# EAGLE design control_panel (EAGLE 5.09)
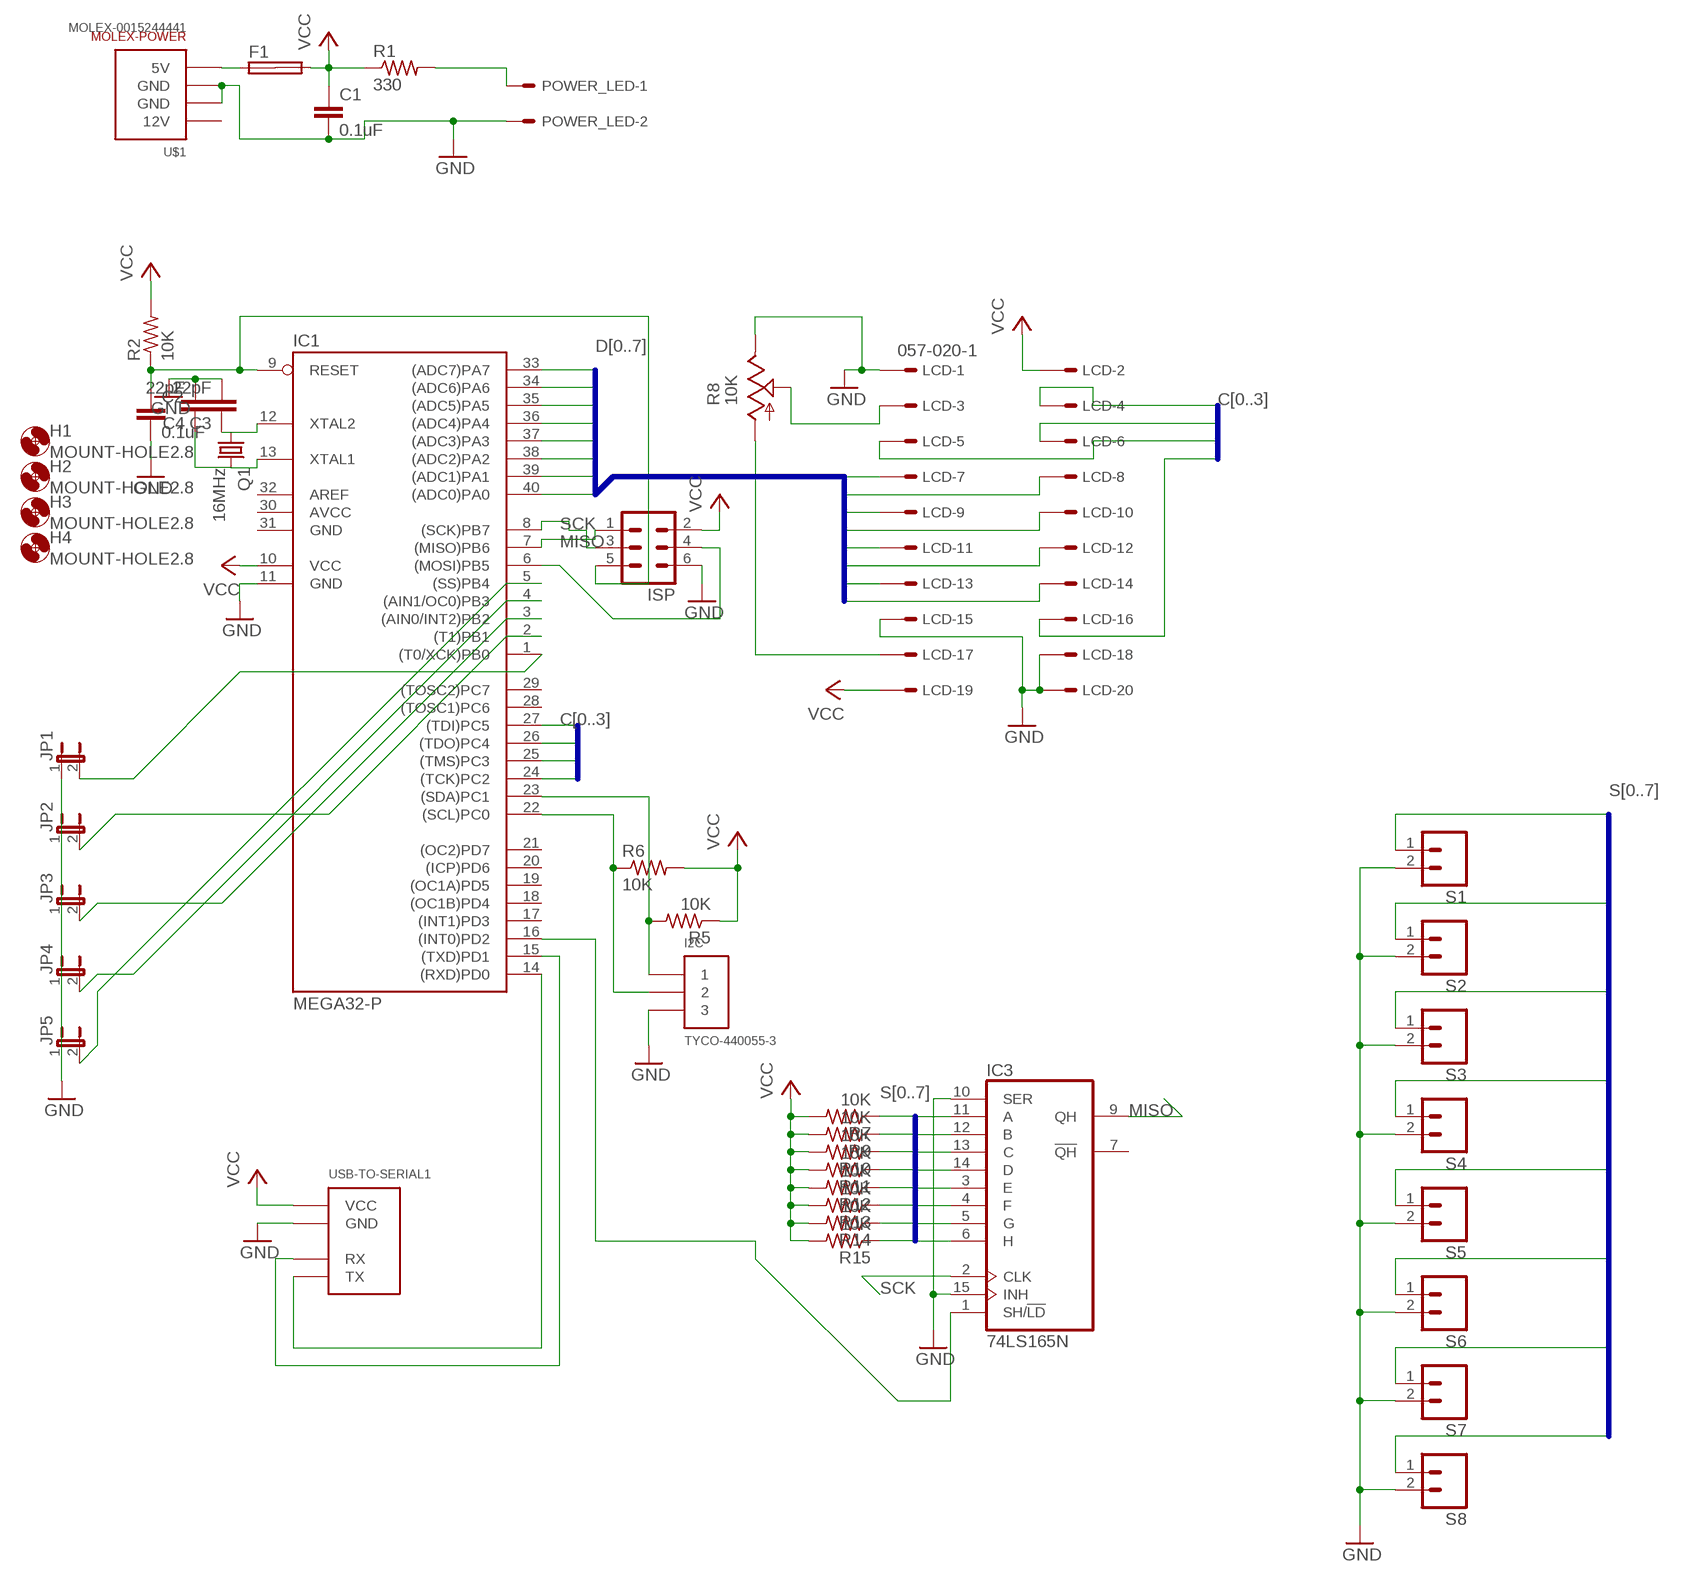
[diagram p0: schematic, sheet 1]

## Parts
C1  0.1uF  C2.5/4  [C2.5-4]
C2  0.1uF  C5/3  [C5B3]
C3  22pF  C2.5/4  [C2.5-4]
C4  22pF  C2.5/4  [C2.5-4]
F1  SHK20Q  [SHK20Q]
H1  MOUNT-HOLE2.8  [2,8]
H2  MOUNT-HOLE2.8  [2,8]
H3  MOUNT-HOLE2.8  [2,8]
H4  MOUNT-HOLE2.8  [2,8]
I2C  TYCO-440055-3  [HEADER-RA-2.00MM-3]
IC1  MEGA32-P  [DIL40]
IC3  74LS165N  [DIL16]
ISP  MA03-2  [MA03-2]
JP1  JUMPER-2PTH  [1X02]
JP2  JUMPER-2PTH  [1X02]
JP3  JUMPER-2PTH  [1X02]
JP4  JUMPER-2PTH  [1X02]
JP5  JUMPER-2PTH  [1X02]
LCD  057-020-1  [057-020-1]
POWER_LED  KK-156-2  [KK-156-2]
Q1  16MHz  CRYSTALHC49S  [HC49/S]
R1  330  R-US_0204/7  [0204/7]
R2  10K  R-US_0204/7  [0204/7]
R5  10K  R-US_0204/7  [0204/7]
R6  10K  R-US_0204/7  [0204/7]
R7  10K  R-US_0204/7  [0204/7]
R8  10K  TRIM_US-B25U  [B25U]
R9  10K  R-US_0204/7  [0204/7]
R10  10K  R-US_0204/7  [0204/7]
R11  10K  R-US_0204/7  [0204/7]
R12  10K  R-US_0204/7  [0204/7]
R13  10K  R-US_0204/7  [0204/7]
R14  10K  R-US_0204/7  [0204/7]
R15  10K  R-US_0204/7  [0204/7]
S1  M02PTH  [1X02]
S2  M02PTH  [1X02]
S3  M02PTH  [1X02]
S4  M02PTH  [1X02]
S5  M02PTH  [1X02]
S6  M02PTH  [1X02]
S7  M02PTH  [1X02]
S8  M02PTH  [1X02]
U$1  MOLEX-0015244441  [MOLEX-0015244441B]
USB-TO-SERIAL1  USB-TO-SERIAL-SQUARE  [USB-TO-SERIAL.SQUARE]

## Nets
C0: IC1.24((TCK)PC2) LCD.4
C1: IC1.25((TMS)PC3) LCD.6
C2: IC1.26((TDO)PC4) LCD.5
C3: IC1.27((TDI)PC5) LCD.16
D0: IC1.40((ADC0)PA0) LCD.7
D1: IC1.39((ADC1)PA1) LCD.8
D2: IC1.38((ADC2)PA2) LCD.9
D3: IC1.37((ADC3)PA3) LCD.10
D4: IC1.36((ADC4)PA4) LCD.11
D5: IC1.35((ADC5)PA5) LCD.12
D6: IC1.34((ADC6)PA6) LCD.13
D7: IC1.33((ADC7)PA7) LCD.14
GND: C1.2 C2.2 C3.2 C4.2 I2C.3 IC1.11(GND) IC3.10(SER) IC3.15(INH) ISP.6 JP1.1 JP2.1 JP3.1 JP4.1 JP5.1 LCD.1 LCD.15 LCD.18 LCD.20 POWER_LED.2 R8.E S1.2 S2.2 S3.2 S4.2 S5.2 S6.2 S7.2 S8.2 U$1.2(GND) U$1.3(GND) USB-TO-SERIAL1.GND
MISO: IC1.7((MISO)PB6) IC3.9(QH) ISP.1
N$1: F1.1A U$1.4(5V)
N$2: POWER_LED.1 R1.2
N$3: C2.1 IC1.9(RESET) ISP.5 R2.1
N$4: IC1.16((INT0)PD2) IC3.1(SH/!LD)
N$5: C4.1 IC1.13(XTAL1) Q1.2
N$7: IC1.14((RXD)PD0) USB-TO-SERIAL1.TX
N$8: IC1.15((TXD)PD1) USB-TO-SERIAL1.RX
N$9: IC1.1((T0/XCK)PB0) JP1.2
N$10: IC1.2((T1)PB1) JP2.2
N$11: IC1.3((AIN0/INT2)PB2) JP3.2
N$12: IC1.4((AIN1/OC0)PB3) JP4.2
N$13: IC1.5((SS)PB4) JP5.2
N$14: I2C.1 IC1.23((SDA)PC1) R5.2
N$15: I2C.2 IC1.22((SCL)PC0) R6.1
N$16: C3.1 IC1.12(XTAL2) Q1.1
N$19: IC1.6((MOSI)PB5) ISP.4
N$20: LCD.3 R8.S
N$21: LCD.17 R8.A
S0: IC3.11(A) R7.1 S1.1
S1: IC3.12(B) R9.1 S2.1
S2: IC3.13(C) R10.1 S3.1
S3: IC3.14(D) R11.1 S4.1
S4: IC3.3(E) R12.1 S5.1
S5: IC3.4(F) R13.1 S6.1
S6: IC3.5(G) R14.1 S7.1
S7: IC3.6(H) R15.1 S8.1
SCK: IC1.8((SCK)PB7) IC3.2(CLK) ISP.3
VCC: C1.1 F1.2A IC1.10(VCC) ISP.2 LCD.2 LCD.19 R1.1 R2.2 R5.1 R6.2 R7.2 R9.2 R10.2 R11.2 R12.2 R13.2 R14.2 R15.2 USB-TO-SERIAL1.VCC
Unconnected: F1.1B F1.2B IC1.17((INT1)PD3) IC1.18((OC1B)PD4) IC1.19((OC1A)PD5) IC1.20((ICP)PD6) IC1.21((OC2)PD7) IC1.28((TOSC1)PC6) IC1.29((TOSC2)PC7) IC1.32(AREF) IC3.7(!QH)

## Buses
D[0..7]
S[0..7]
C[0..3]

## Power pins joined to a net without a drawn wire
12V: U$1.1(12V)
AVCC: IC1.30(AVCC)
GND: IC1.31(GND) IC3.8(GND)
VCC: IC3.16(VCC)

## Library data of the parts
C1-C4 = capacitor-wima:C: CAPACITOR naming: grid - package width
F1 = fuse:SHK20Q: FUSE HOLDER 5 x 20 mm, SH contact, E1207 Buerklin 64G6061
H1-H4 = holes:MOUNT-HOLE: MOUNTING HOLE with drill center marker
I2C = chicagoedt:TYCO-440055-3: 3 pin right angle header with shroud and 2.00 mm pitch.
IC1 = atmel:MEGA32-P: MICROCONTROLLER 32 Kbytes FLASH 2 Kbytes SRAM 1 Kbytes EEPROM USART 8-channel 10 bit ADC Source: www.atmel.com .. doc2503.pdf
IC3 = 74xx-us:74*165: 8-bit parallel load SHIFT REGISTER
ISP = con-lstb:MA03-2: PIN HEADER
JP1-JP5 = SparkFun:JUMPER-2: Jumper Basic 0.1" spaced jumper. Use with breakaway headers.
LCD = con-panduit:057-020-: CONNECTOR 20-pin series 057 contact pc board low profile headers
POWER_LED = con-molex:KK-156-2: KK 156 HEADER Source: http://www.molex.com/pdm_docs/sd/026604100_sd.pdf
Q1 = crystal:CRYSTAL: CRYSTAL
R1 R2 R5-R7 R9-R15 = rcl:R-US_: RESISTOR, American symbol
R8 = pot:TRIM_US-: POTENTIOMETER
S1-S8 = SparkFun:M02: Header 2 Standard 2-pin 0.1" header. Use with straight break away headers (SKU : PRT-00116), right angle break away headers (PRT-00553), swiss pins (PRT-00743), machine pins (PRT-00117), and female headers (PRT-00115). Molex polarized connector foot print use with SKU : PRT-08233 with associated crimp pins and housings.
U$1 = chicagoedt:MOLEX-0015244441: 5.08mm (.200") Pitch Disk Drive Power Connection System Header, Right Angle, Through Hole, 4 Circuits, Lead-free, 3.56mm (.140") PC Tail Length, with PCB Locator Peg
USB-TO-SERIAL1 = chicagoedt:USB-TO-SERIAL-SQUARE

## Board
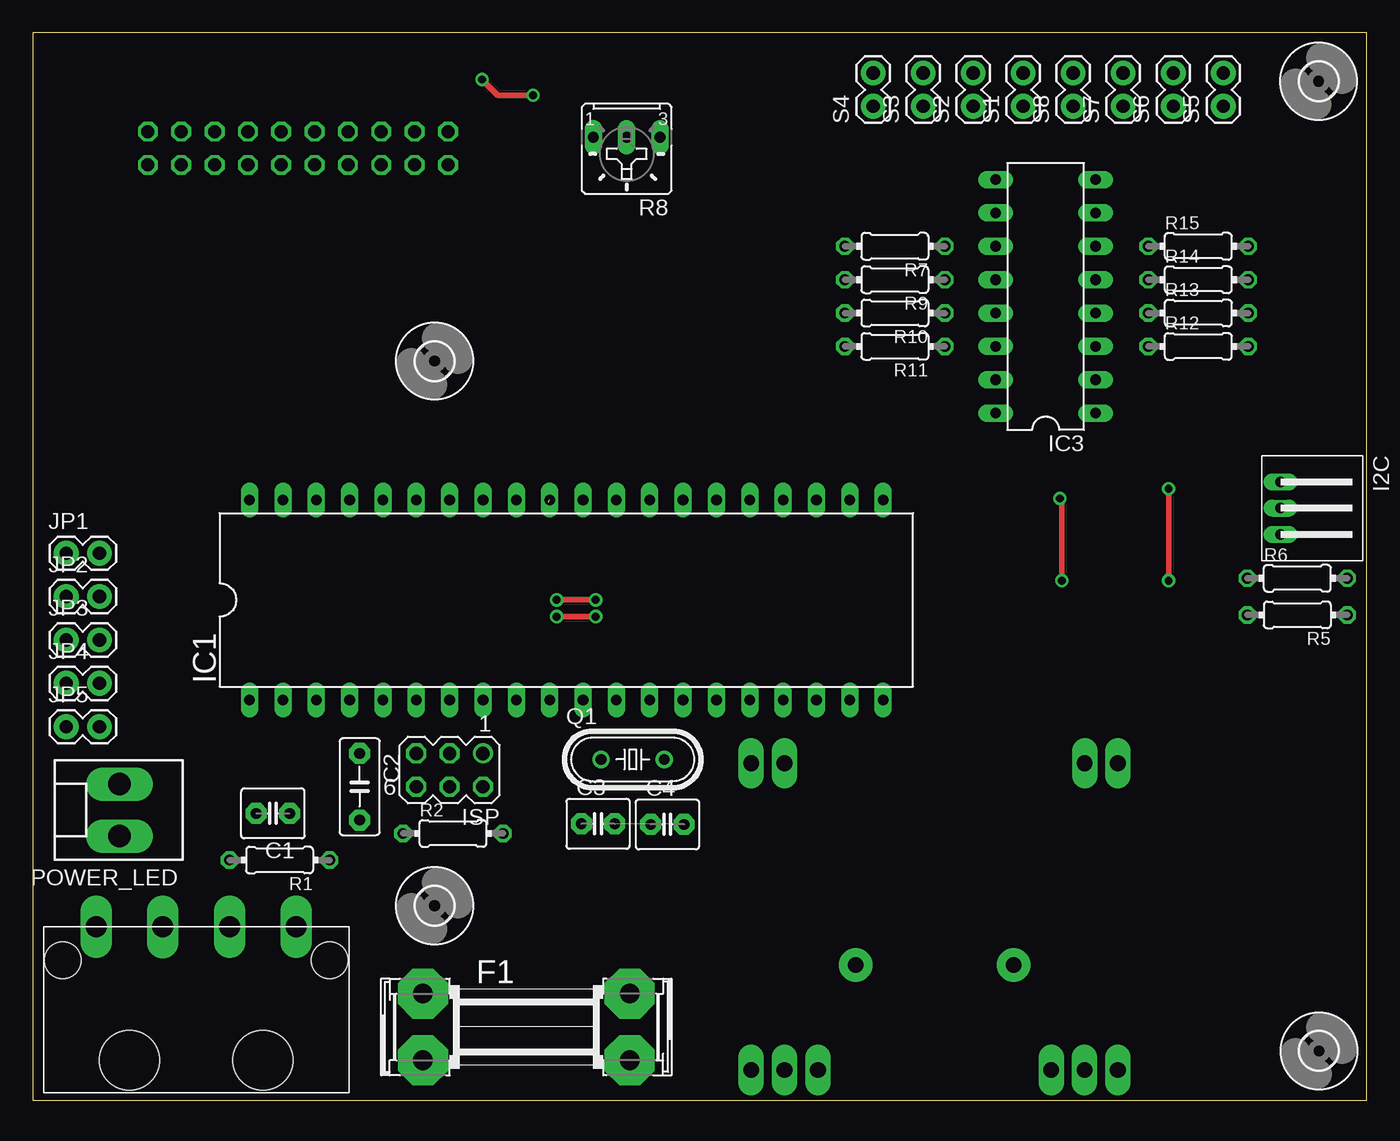
[diagram p1: board, top side]
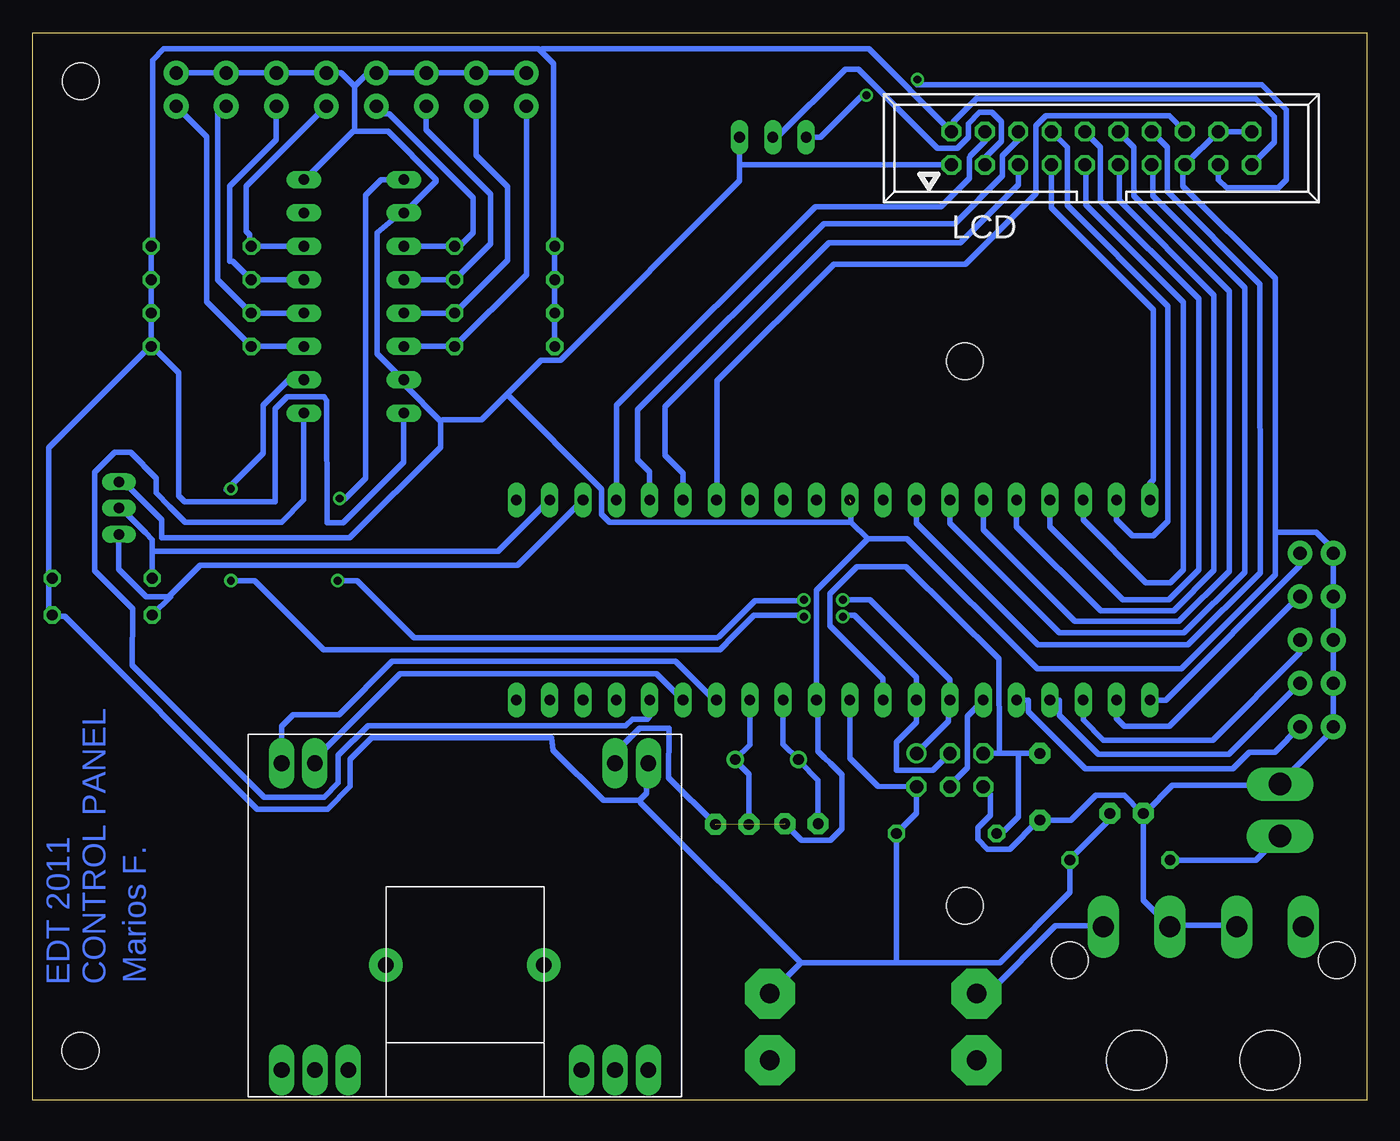
[diagram p2: board, bottom side, seen from below]

Size 101.6 x 81.28 mm. Coordinates in mm from the lower left corner, seen from the top.
Outline: 0,0 101.6,0 101.6,81.28 0,81.28 0,0
Copper layers (1*16): Top 0.035mm / dielectric 1.5mm / Bottom 0.035mm
Design rules "default *": minimum track width 16mil, minimum drill 24mil, track to track 10mil, track to pad 7mil, pad to pad 10mil, via to via 10mil, smd to smd 8mil, copper to edge 40mil, drill to drill 8mil, minimum pad ring 10mil, minimum via ring 8mil, stop-mask expansion 4mil, vias tented up to drill 0mil, thermal gap 10mil

### Footprints (pad centres in the part's own frame; a part is rotated, then mirrored left to right if it is on the bottom)
C2.5-4 = drill 0.813 pad 1.6 octagon: 1 -1.27,0; 2 1.27,0
C5B3 = drill 0.813 pad 1.6 octagon: 1 -2.54,0; 2 2.54,0
SHK20Q = drill 1.5 pad 3.81 octagon: 1A -7.874,2.54; 1B -7.874,-2.54; 2A 7.874,2.54; 2B 7.874,-2.54
2,8 = hole 2.8: 0,0
HEADER-RA-2.00MM-3 = drill 0.8 long: 1 2,0; 2 0,0; 3 -2,0
DIL40 = drill 0.813 long: 1 -24.13,-7.62; 2 -21.59,-7.62; 3 -19.05,-7.62; 4 -16.51,-7.62; 5 -13.97,-7.62; 6 -11.43,-7.62; 7 -8.89,-7.62; 8 -6.35,-7.62; 9 -3.81,-7.62; 10 -1.27,-7.62; 11 1.27,-7.62; 12 3.81,-7.62; 13 6.35,-7.62; 14 8.89,-7.62; 15 11.43,-7.62; 16 13.97,-7.62; 17 16.51,-7.62; 18 19.05,-7.62; 19 21.59,-7.62; 20 24.13,-7.62; 21 24.13,7.62; 22 21.59,7.62; 23 19.05,7.62; 24 16.51,7.62; 25 13.97,7.62; 26 11.43,7.62; 27 8.89,7.62; 28 6.35,7.62; 29 3.81,7.62; 30 1.27,7.62; 31 -1.27,7.62; 32 -3.81,7.62; 33 -6.35,7.62; 34 -8.89,7.62; 35 -11.43,7.62; 36 -13.97,7.62; 37 -16.51,7.62; 38 -19.05,7.62; 39 -21.59,7.62; 40 -24.13,7.62
DIL16 = drill 0.813 long: 1 -8.89,-3.81; 2 -6.35,-3.81; 3 -3.81,-3.81; 4 -1.27,-3.81; 5 1.27,-3.81; 6 3.81,-3.81; 7 6.35,-3.81; 8 8.89,-3.81; 9 8.89,3.81; 10 6.35,3.81; 11 3.81,3.81; 12 1.27,3.81; 13 -1.27,3.81; 14 -3.81,3.81; 15 -6.35,3.81; 16 -8.89,3.81
MA03-2 = drill 1.016 round: 1 -2.54,-1.27 | drill 1.016 octagon: 2 -2.54,1.27; 3 0,-1.27; 4 0,1.27; 5 2.54,-1.27; 6 2.54,1.27
1X02 = drill 1.016 pad 1.88 round: 1 0,0; 2 2.54,0
057-020-1 = drill 1 octagon: 1 -11.43,-1.27; 2 -11.43,1.27; 3 -8.89,-1.27; 4 -8.89,1.27; 5 -6.35,-1.27; 6 -6.35,1.27; 7 -3.81,-1.27; 8 -3.81,1.27; 9 -1.27,-1.27; 10 -1.27,1.27; 11 1.27,-1.27; 12 1.27,1.27; 13 3.81,-1.27; 14 3.81,1.27; 15 6.35,-1.27; 16 6.35,1.27; 17 8.89,-1.27; 18 8.89,1.27; 19 11.43,-1.27; 20 11.43,1.27
KK-156-2 = drill 1.7 pad 2.184 long: 1 -1.98,0; 2 1.98,0
HC49/S = drill 0.813 round: 1 -2.413,0; 2 2.413,0
0204/7 = drill 0.813 octagon: 1 -3.81,0; 2 3.81,0
B25U = drill 0.813 long: A 2.54,-0.889; E -2.54,-0.889; S 0,-0.889
MOLEX-0015244441B = drill 1.587 pad 1.778 long: 1 7.62,-6.35; 3 -2.54,-6.35; 4 -7.62,-6.35 | drill 1.6 pad 1.651 long: 2 2.54,-6.35 | hole 2.794: -10.16,-3.81; 10.16,-3.81 | hole 4.572: -5.08,3.81; 5.08,3.81
USB-TO-SERIAL.SQUARE = drill 1.2 pad 1.93 long: GND 11.595,11.425; P$1 -11.76,13.965; P$2 -11.76,11.425; P$3 -11.76,8.885; P$4 -11.76,-8.885; P$7 -11.76,-11.425; P$8 -11.76,-13.965; RX 11.595,-11.435; TX 11.595,-13.975; VCC 11.595,13.965 | drill 1.2 pad 2.54 round: P$5 -3.771,-6.023; P$6 -3.771,6.01

### Placement (x,y rotation side)
C1  18.29,21.84 180 top
C2  24.89,23.88 270 top
C3  43.05,21.06 0 top
C4  48.34,21.01 0 top
F1  37.59,5.59 0 top
H1  97.97,3.76 0 top
H2  97.94,77.6 0 top
H3  30.61,56.29 0 top
H4  30.61,14.81 0 top
I2C  95.05,45.09 270 top
IC1  40.64,38.1 0 top
IC3  77.15,61.21 90 top
ISP  31.75,25.15 180 top
JP1  2.54,41.66 0 top
JP2  2.54,38.35 0 top
JP3  2.54,35.05 0 top
JP4  2.54,31.75 0 top
JP5  2.54,28.45 0 top
LCD  20.19,72.49 0 bottom
POWER_LED  6.6,22.1 90 top
Q1  45.69,25.96 0 top
R1  18.8,18.29 180 top
R2  32,20.32 0 top
R5  96.32,36.96 180 top
R6  96.32,39.75 0 top
R7  65.66,65.02 180 top
R8  45.24,72.44 180 top
R9  65.66,62.48 180 top
R10  65.66,59.94 180 top
R11  65.66,57.4 180 top
R12  88.77,57.4 0 top
R13  88.77,59.94 0 top
R14  88.77,62.48 0 top
R15  88.77,65.02 0 top
S1  75.44,75.69 90 top
S2  71.63,75.69 90 top
S3  67.82,75.69 90 top
S4  64.01,75.69 90 top
S5  90.68,75.69 90 top
S6  86.87,75.69 90 top
S7  83.06,75.69 90 top
S8  79.25,75.69 90 top
U$1  12.45,6.86 180 top
USB-TO-SERIAL1  68.68,14.07 90 top

### Tracks (layer width: path | path; a pad name or v marks a point on that pad's centre or on a via)
C0
  Bottom 0.406: LCD.4 29.06,73.05 30.2,71.91 30.28,71.78 30.28,70.21 32.44,68.05 41.99,68.05 57.12,52.91 57.12,45.74 IC1.24
C1
  Bottom 0.406: LCD.6 26.54,73.13 27.74,71.93 27.74,70.38 31.37,66.75 41.35,66.75 55.52,52.58 55.52,48.77 54.61,47.85 IC1.25
C2
  Bottom 0.406: LCD.5 26.54,69.7 30.96,65.28 40.97,65.28 53.44,52.81 53.44,49.1 52.07,47.73 IC1.26
C3
  Bottom 0.406: LCD.16 15.04,74.95 24.43,74.95 25.2,74.19 25.2,69.04 30.56,63.68 40.59,63.68 49.48,54.79 49.48,45.77 IC1.27
D0
  Bottom 0.406: IC1.40 16.51,46.99 16.26,47.24 16.26,60.2 24,67.94 LCD.7
D1
  Bottom 0.406: LCD.8 22.81,72.57 22.81,68.15 15.14,60.48 15.14,44.11 16.27,42.98 17.83,42.98 19.05,44.2 IC1.39
D2
  Bottom 0.406: LCD.9 21.39,70.79 21.39,68.17 13.97,60.76 13.97,40.41 14.96,39.42 16.82,39.42 21.59,44.2 IC1.38
D3
  Bottom 0.406: LCD.10 20.27,72.57 20.27,68.5 12.8,61.04 12.8,40.4 15.09,38.11 18.55,38.11 24.13,43.69 IC1.37
D4
  Bottom 0.406: LCD.11 18.85,70.28 18.85,68.53 11.63,61.32 11.63,40.35 14.71,37.27 20.26,37.27 26.67,43.69 IC1.36
D5
  Bottom 0.406: LCD.12 17.73,72.57 17.73,68.86 10.46,61.59 10.46,40.3 14.3,36.46 22.24,36.46 29.21,43.43 IC1.35
D6
  Bottom 0.406: LCD.13 16.31,70.79 16.31,68.89 9.3,61.87 9.3,40.22 13.92,35.6 23.41,35.6 31.75,43.94 IC1.34
D7
  Bottom 0.406: LCD.14 15.19,72.57 15.19,69.22 8.13,62.15 8.12,40.18 13.61,34.7 25.04,34.7 34.29,43.94 IC1.33
GND  (2 unrouted)
  Bottom 0.406: 77.09,73.79 74.55,73.79 70.87,70.1 70.87,69.98 73.28,67.56 IC3.10 73.53,67.56 75.36,66.04 75.36,56.84 73.41,54.86 IC3.15 73.25,54.69 73.25,54.43 70.54,51.71 | 77.09,73.79 77.22,73.79 80.9,70.1 IC3.8 | 77.09,77.22 76.07,78.23 S1.2 S2.2 S3.2 S4.2 | 77.09,73.79 77.09,77.22 | 77.09,77.22 78.11,78.23 S8.2 S7.2 S6.2 S5.2 | C1.2 17.02,15.24 U$1.3 14.94,13.34 9.96,13.34 U$1.2 | C1.2 16.84,21.95 14.81,23.98 6.78,23.98 POWER_LED.2 6.6,24.16 2.64,28.12 2.64,28.27 JP5.1 JP4.1 JP3.1 JP2.1 JP1.1 2.54,41.96 3.83,43.26 6.96,43.26 | C1.2 17.2,21.95 18.47,23.22 20.62,23.22 22.53,21.34 C2.2 25.07,21.23 27.18,19.13 28.88,19.13 29.62,19.86 29.62,20.75 28.65,21.72 28.65,23.32 ISP.6 | 6.96,43.26 6.96,40.03 14.13,32.84 25.09,32.84 35,42.75 38,42.75 | USB-TO-SERIAL1.GND 57.2,26.52 55.4,28.35 53.14,28.35 53.16,24.56 C4.2 | IC1.11 42.09,30.38 | 39.27,44.02 39.27,45.54 | I2C.3 95.05,47.07 94.87,47.07 94.69,47.12 91.8,44.22 91.8,42.85 77.47,42.85 70.54,49.73 70.54,51.71 | 65.49,53.76 62.89,56.36 61.42,56.36 47.78,70 47.78,71.22 | 65.49,53.76 67.44,51.82 70.36,51.82 70.54,51.71 | 47.78,71.22 R8.E | 65.49,53.76 58.27,46.53 58.27,44.63 57.66,44.02 39.27,44.02 | LCD.20 LCD.18 LCD.15 14.02,71.12 14.02,69.6 6.96,62.59 6.96,43.26 | 47.78,71.22 LCD.1 | C3.2 43.05,19.79 40.84,19.79 39.95,20.68 39.95,24.79 40.84,25.65 41.3,26.09 41.81,26.59 41.81,30.3 IC1.11 | 38,42.75 39.27,44.02 | 38,42.75 41.91,38.84 IC1.11
MISO  (via drill 0.6)
  Top 0.406: v78.38,39.57 78.38,45.67 v78.23,45.82 | v39.9,38.1 v42.88,38.1
  Bottom 0.406: v78.23,45.82 77.8,45.82 76.25,47.37 76.25,68.91 75.06,70.1 IC3.9 | v78.38,39.57 76.91,39.57 72.54,35.2 49.51,35.2 49.33,35.31 46.58,38.05 42.88,38.05 | ISP.1 31.85,28.85 31.85,30.3 IC1.7 31.75,32.03 37.82,38.1 v39.9,38.1 | 42.88,38.05 42.72,38.05 | v42.88,38.1 42.88,38.05
N$1
  Bottom 0.406: F1.1A 28.85,8.13 23.7,13.28 20.14,13.28 U$1.4
N$2
  Bottom 0.406: R1.2 8.43,18.29 POWER_LED.1
N$3
  Bottom 0.406: 26.54,26.42 C2.1 | 26.54,26.42 27.99,26.42 | 27.99,26.42 ISP.5 | IC1.9 36.83,32.08 40.87,36.12 40.87,38.58 38.82,40.63 35.08,40.63 28.02,33.62 27.99,26.42 | R2.1 27.99,20.52 27.61,20.52 26.54,21.59 26.54,26.42
N$4
  Bottom 0.406: IC1.16 54.61,29.21 54.79,29.03 55.93,29.03 56.44,28.52 76.07,28.52 78.33,26.26 78.33,24.18 79.43,23.09 83.97,23.09 94.03,33.12 94,37.41 96.88,40.31 96.88,41.6 96.9,47.8 95.35,49.35 94.21,49.35 94.16,49.33 92.2,47.37 92.2,46.25 91.16,45.21 89.99,44.02 82.65,44.02 80.96,45.73 IC3.1
N$5
  Bottom 0.406: IC1.13 46.99,27.08 Q1.2 48.01,25.78 47.07,24.84 C4.1
N$7
  Bottom 0.406: IC1.14 49.73,30.5 52.65,33.43 74.22,33.43 78.28,29.36 81.79,29.36 82.65,28.5 USB-TO-SERIAL1.TX
N$8
  Bottom 0.406: IC1.15 54.08,32.49 73.64,32.49 80.11,26.01 USB-TO-SERIAL1.RX
N$9
  Bottom 0.406: JP1.2 5.08,40.69 15.29,30.48 IC1.1
N$10
  Bottom 0.406: JP2.2 5.18,38.35 15.04,28.5 18.47,28.5 19.05,29.08 IC1.2
N$11
  Bottom 0.406: IC1.3 21.59,28.98 20.04,27.43 11.73,27.43 5.08,34.09 JP3.2
N$12
  Bottom 0.406: IC1.4 23.42,30.48 23.42,29.31 20.45,26.34 10.52,26.34 JP4.2
N$13
  Bottom 0.406: IC1.5 25.78,30.48 25.78,29.59 21.44,25.25 10.21,25.25 8.94,26.52 7.01,26.52 JP5.2
N$14
  Bottom 0.406: 60.02,45.72 IC1.23 64.67,40.74 88.85,40.74 91.26,38.33 | 91.26,38.33 91.11,38.35 R5.2 | 91.26,38.33 92.96,38.35 95.05,40.44 I2C.1
N$15
  Bottom 0.406: 92.49,41.8 89.56,41.81 66.12,41.81 66.12,41.83 IC1.22 62.56,45.72 | 92.49,41.8 R6.1 | I2C.2 94.87,45.09 93.02,43.2 92.49,42.69 92.49,41.8
N$16
  Bottom 0.406: IC1.12 44.45,27.13 Q1.1 43.18,25.78 41.78,24.38 C3.1
N$19
  Bottom 0.406: ISP.4 31.75,24 30.43,25.32 30.43,29.26 IC1.6
N$20
  Bottom 0.406: R8.S 44.91,73.33 39.7,78.51 38.71,78.51 32.72,72.49 31.19,72.49 30.35,73.33 30.35,74.35 29.49,75.23 28.55,75.23 27.81,74.5 27.81,73.01 29.07,71.75 LCD.3
N$21  (via drill 0.6)
  Top 0.406: v38.1,76.53 35.41,76.53 v34.21,77.72
  Bottom 0.406: LCD.17 11.3,70.1 10.67,69.47 6.73,69.47 6.12,70.08 6.12,75.44 8,77.34 34.27,77.34 34.27,77.55 v34.21,77.72 | 38.33,76.53 v38.1,76.53 38.51,76.43 41.6,73.33 R8.A
S0
  Bottom 0.406: IC3.11 R7.1 69.34,65.15 68.96,65.15 68.07,66.04 68.07,68.73 74.45,75.11 74.85,75.11 S1.1
S1
  Bottom 0.406: IC3.12 R9.1 66.75,65.2 66.75,68.99 71.65,73.89 71.65,75.67 S2.1
S2
  Bottom 0.406: IC3.13 R10.1 65.43,63.98 65.43,69.57 67.82,71.96 S3.1
S3
  Bottom 0.406: IC3.14 R11.1 63.98,62.87 64.01,69.16 S4.1
S4
  Bottom 0.406: IC3.3 R12.1 88.37,60.81 88.37,73.38 S5.1
S5
  Bottom 0.406: IC3.4 R13.1 87.5,62.48 87.5,75.49 S6.1
S6
  Bottom 0.406: IC3.5 R14.1 86.36,63.88 86.59,63.88 86.59,69.6 83.06,73.13 S7.1
S7
  Bottom 0.406: IC3.6 R15.1 85.09,65.15 85.09,65.91 85.34,66.17 85.34,69.6 S8.1
SCK  (via drill 0.6)
  Top 0.406: v86.51,39.57 v86.51,46.56 | v39.9,36.83 v42.88,36.83
  Bottom 0.406: 86.65,46.7 84.07,49.25 84.07,52.91 82.12,54.86 IC3.2 | 86.65,46.7 86.87,46.48 | v86.51,46.56 86.65,46.7 | v86.51,39.57 84.68,39.57 79.45,34.31 49.25,34.31 48.77,34.8 48.69,34.9 46.66,36.93 42.88,36.93 | 42.88,36.93 42.6,36.93 | v39.9,36.83 39.93,36.85 39.93,36.93 39.01,36.93 34.29,32.21 IC1.8 34.29,28.78 35.81,27.25 35.81,25.12 33.05,25.12 ISP.3 | v42.88,36.83 42.88,36.93
VCC
  Bottom 0.406: R11.2 R10.2 R9.2 R7.2 61.95,65.2 61.95,78.94 62.93,79.92 | R12.2 R13.2 R14.2 R15.2 92.48,65.2 92.48,79.2 91.62,80.06 63.07,80.06 62.93,79.92 | 35.81,10.49 27.94,10.49 22.61,15.82 R1.1 22.5,18.47 19.56,21.41 C1.1 | 35.81,10.49 43.1,10.49 | 43.1,10.49 F1.2A | ISP.2 34.29,21.84 R2.2 35.81,10.49 | IC1.10 39.37,28.52 39.34,26.04 37.24,23.9 ISP.2 | ISP.2 34.39,24.05 | 54.74,25.68 USB-TO-SERIAL1.VCC 54.79,25.48 54.79,25.25 54.86,23.37 55.4,22.84 | R12.2 92.76,57.3 100.38,49.68 100.38,40.08 100.23,39.93 R6.2 100.38,39.5 100.38,37.21 R5.1 99.95,36.85 99.19,36.85 84.51,22.17 79.15,22.17 77.42,23.9 77.42,25.98 75.79,27.61 62.08,27.61 61.98,26.67 58.14,22.84 55.4,22.84 | R12.2 92.41,57.3 90.5,55.4 90.5,46.02 90.04,45.57 83.16,45.57 83.16,52.65 82.25,53.57 79.43,53.57 79.22,53.26 79.2,43.97 77.95,43.97 73.36,48.56 73.36,51.54 IC3.16 | 62.93,79.92 62.79,80.06 37.92,80.06 LCD.2 31.5,73.91 31.5,74.5 29.69,76.3 29.67,76.28 8.43,76.28 7.04,74.88 7.04,72.95 LCD.19 | ISP.2 34.47,23.75 | 43.1,10.49 43.26,10.62 55.3,22.66 55.4,22.84

### Text on the board
Bottom: CONTROL PANEL | EDT 2011 | Marios F.